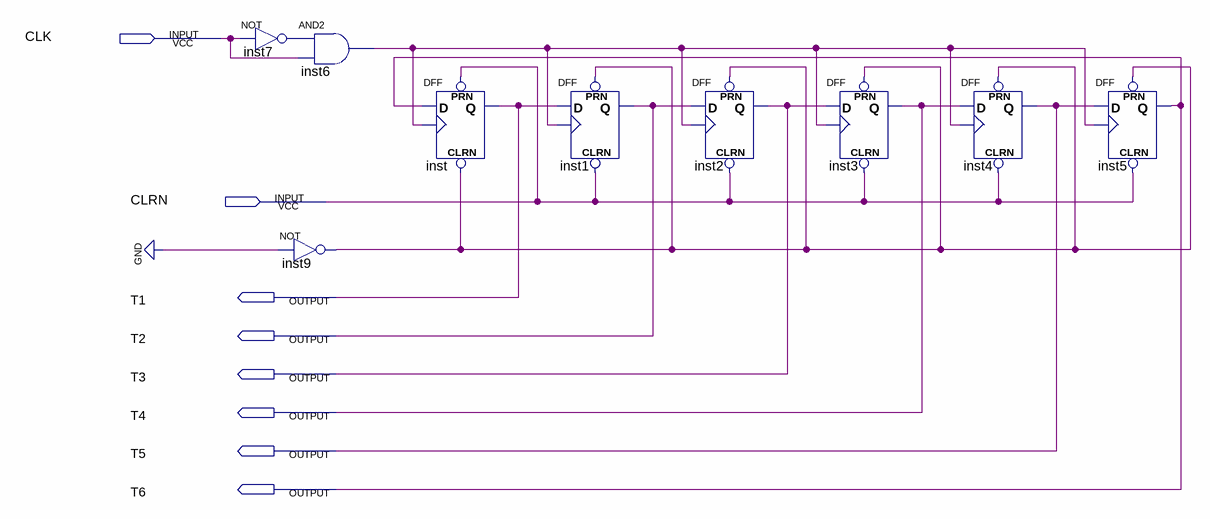
[diagram p0: schematic sheet]
// Quartus schematic Contador_Anel.bdf as structural Verilog: 9 symbols, 8 pins
module Contador_Anel (
  input  CLK,
  input  CLRN,
  output T1,
  output T2,
  output T3,
  output T4,
  output T5,
  output T6
);

  wire inst6_out, inst7_out, inst9_out;

  not inst7 (inst7_out, CLK);
  and inst6 (inst6_out, inst7_out, CLK);
  not inst9 (inst9_out, 1'b0);
  DFF inst (.CLRN(inst9_out), .CLK(inst6_out), .D(T6), .PRN(CLRN), .Q(T1));
  DFF inst1 (.CLRN(CLRN), .CLK(inst6_out), .D(T1), .PRN(inst9_out), .Q(T2));
  DFF inst2 (.CLRN(CLRN), .CLK(inst6_out), .D(T2), .PRN(inst9_out), .Q(T3));
  DFF inst3 (.CLRN(CLRN), .CLK(inst6_out), .D(T3), .PRN(inst9_out), .Q(T4));
  DFF inst4 (.CLRN(CLRN), .CLK(inst6_out), .D(T4), .PRN(inst9_out), .Q(T5));
  DFF inst5 (.CLRN(CLRN), .CLK(inst6_out), .D(T5), .PRN(inst9_out), .Q(T6));
endmodule
